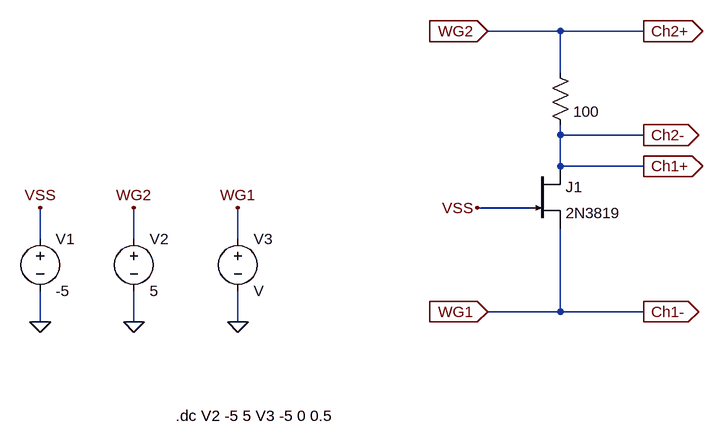
[diagram p0: schematic JFET-curve.asc]
JFET-curve.asc, the LTspice schematic file:
Version 4
SHEET 1 880 692
WIRE 448 64 336 64
WIRE 576 64 448 64
WIRE 448 128 448 64
WIRE 448 224 448 208
WIRE 576 224 448 224
WIRE 448 272 448 224
WIRE 576 272 448 272
WIRE 400 336 320 336
WIRE -352 384 -352 336
WIRE -208 384 -208 336
WIRE -48 384 -48 336
WIRE 448 496 448 368
WIRE 448 496 336 496
WIRE 576 496 448 496
WIRE -352 512 -352 464
WIRE -208 512 -208 464
WIRE -48 512 -48 464
FLAG -208 512 0
FLAG -352 512 0
FLAG -352 336 VSS
FLAG -208 336 WG2
FLAG -48 512 0
FLAG -48 336 WG1
FLAG 320 336 VSS
FLAG 336 64 WG2
IOPIN 336 64 In
FLAG 336 496 WG1
IOPIN 336 496 In
FLAG 576 64 Ch2+
IOPIN 576 64 Out
FLAG 576 224 Ch2-
IOPIN 576 224 Out
FLAG 576 272 Ch1+
IOPIN 576 272 Out
FLAG 576 496 Ch1-
IOPIN 576 496 Out
SYMBOL res 432 112 R0
WINDOW 0 36 40 Invisible 2
SYMATTR InstName RD
SYMATTR Value 100
SYMBOL voltage -352 368 R0
SYMATTR InstName V1
SYMATTR Value -5
SYMATTR Value2 AC 1
SYMBOL voltage -208 368 R0
SYMATTR InstName V2
SYMATTR Value 5
SYMBOL njf 400 272 R0
SYMATTR InstName J1
SYMATTR Value 2N3819
SYMBOL voltage -48 368 R0
SYMATTR InstName V3
TEXT -144 656 Left 2 !.dc V2 -5 5 V3 -5 0 0.5

The netlist it stands for:
* JFET-curve.asc
RD Ch2+ Ch1+ 100
V1 VSS 0 -5 AC 1
V2 Ch2+ 0 5
J1 Ch1+ VSS Ch1- 2N3819
V3 Ch1- 0 V
.model NJF NJF
.model PJF PJF
.lib standard.jft
.dc V2 -5 5 V3 -5 0 0.5
.backanno
.end